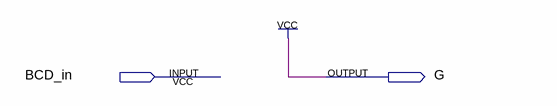
[diagram p0: schematic sheet]
// Quartus schematic DECOD_BCD_G.bdf as structural Verilog: 0 symbols, 2 pins
module DECOD_BCD_G (
  input  BCD_in,
  output G
);


  assign G = 1'b1;
endmodule
